# Altium schematic sheet 降压稳压供电SCH.SchDoc: 降压稳压供电电路
size A4; Author: 许皓阳 15电4; DrawnBy: Staok; Revision: 3.14
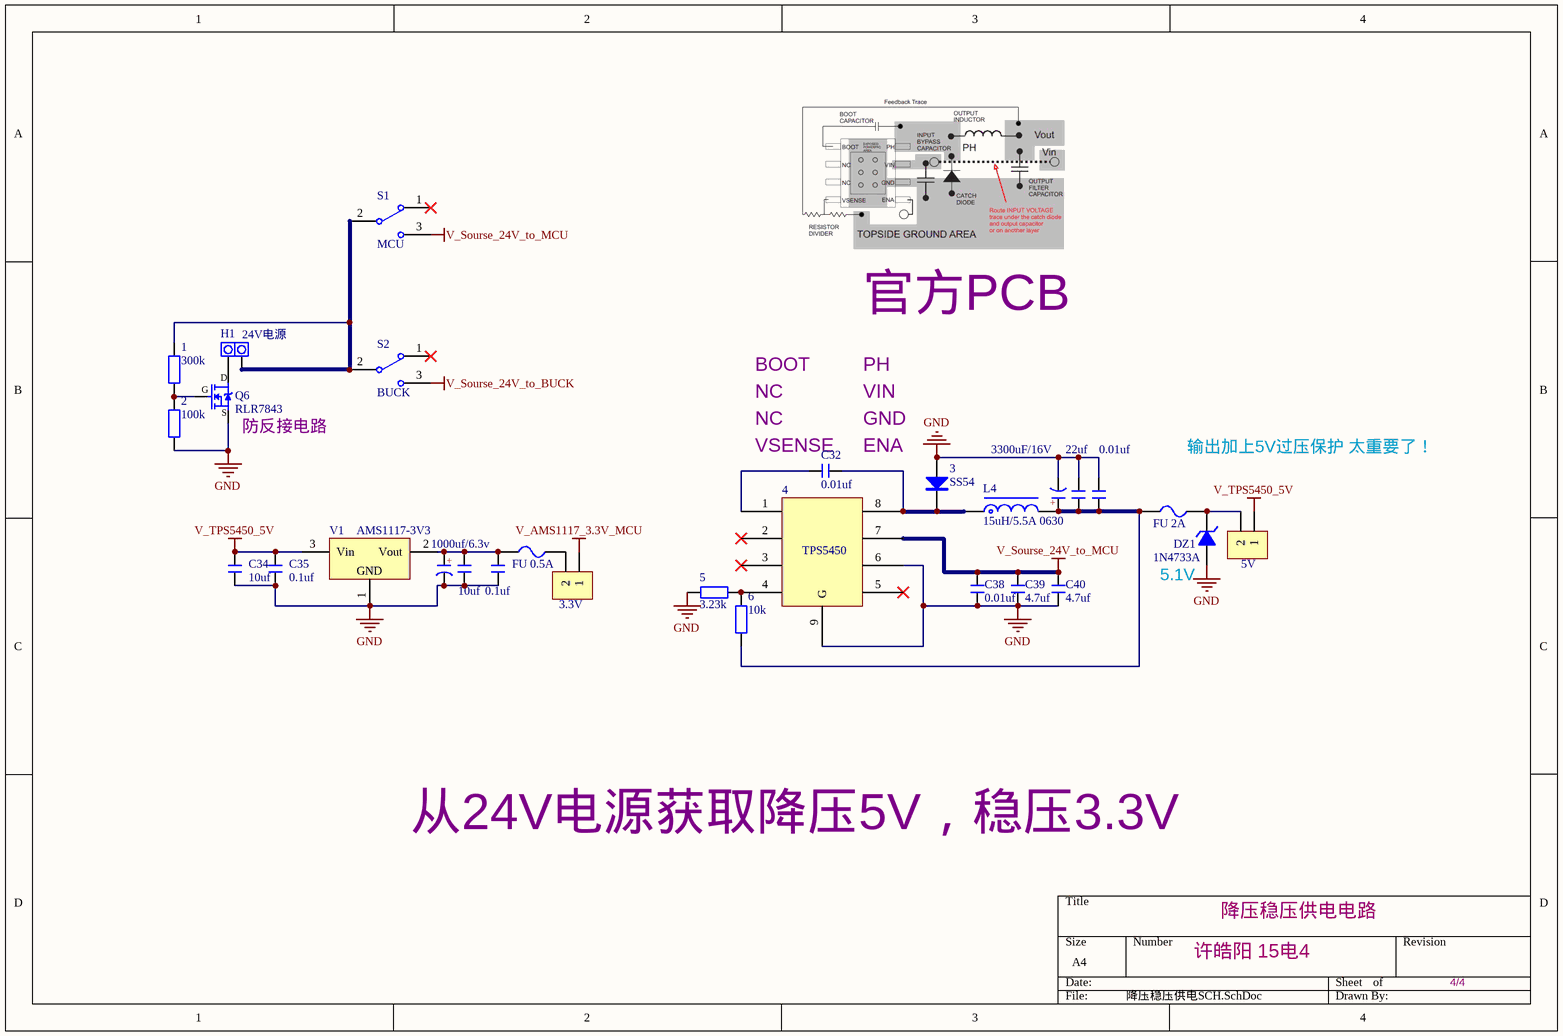
[diagram p0: 降压稳压供电SCH.SchDoc]

## Parts
1  300k  [R 0805_M]
2  100k  [R 0805_M]
3  SS54  [SMA]
4  TPS5450  [ESOP8_M]
5  3.23k  [R 0805_M]
6  10k  [R 0805_M]
C32  0.01uf  [C 0805_M]
C33  0.01uf  [C 0805_M]
C34  10uf  [C 0805_M]
C35  0.1uf  [C 0805_M]
C36  10uf  [C 0805_M]
C36.  22uf  [C 0805_M]
C37  0.1uf  [C 0805_M]
C38  0.01uf  [C 0805_M]
C39  4.7uf  [C 0805_M]
C40  4.7uf  [C 0805_M]
DZ1  1N4733A  [DO-35]
E1  3300uF/16V  [DIP2]
E2  1000uf/6.3v  [DIP2-3.5mm]
F2  FU 2A  [FU 1812]
F3  FU 0.5A  [FU 1206]
H1  24V电源  [T_head]
JP10  5V  [HDR2.54-LI-2P]
JP11  3.3V  [HDR2.54-LI-2P]
L4  15uH/5.5A 0630  [L-SMD-0630]
Q6  RLR7843  [TO252]
S1  MCU  [SK-12D07VG3]
S2  BUCK  [MTS-10x]
V1  AMS1117-3V3  [SOT89_M]

## Nets
GND: 2.1 3.1(A) 4.6 4.9(G) 5.1 C33.2 C34.2 C35.2 C36.2 C36..1 C37.2 C38.1 C39.1 C40.1 DZ1.1(A) E1.2(K) E2.2(K) Q6.3(S) V1.1(GND)
V_AMS1117_3.3V_MCU: JP11.1
V_Sourse_24V_to_BUCK: S2.3
V_Sourse_24V_to_MCU: 4.7 C38.2 C39.2 C40.2 S1.3
V_TPS5450_5V: C34.1 C35.1 JP10.1 V1.3(Vin)
Net1_1: 1.1 2.2 Q6.1(G)
Net1_2: 1.2 H1.2 S1.2 S2.2
Net3_2: 3.2(K) 4.8 C32.2 L4.1
Net4_1: 4.1 C32.1
Net4_4: 4.4 5.2 6.1
Net6_2: 6.2 C33.1 C36..2 E1.1(A) F2.1 L4.2
NetC36_1: C36.1 C37.1 E2.1(A) F3.1 V1.2(Vout)
NetDZ1_2: DZ1.2(K) F2.2 JP10.2
NetF3_2: F3.2 JP11.2
NetH1_1: H1.1 Q6.2(D)

Not connected (* = marked no-connect by the designer): 4 2* 3* 5*; S1 1*; S2 1*

## Notes on the sheet
- BOOT
- PH
- 官方PCB
- (near Q6) 防反接电路
- NC
- GND
- VIN
- (near C32) VSENSE
- ENA
- 输出加上5V过压保护 太重要了！
- (near DZ1) 5.1V
- 从24V电源获取降压5V，稳压3.3V
- 4/4
- (in symbol C-CAP) +

## Library data of the parts
1 2 5 6 = R: 贴片电阻; 版权归属: 源创客; BOM名称: 贴片电阻; 学习资源: www.ooocke.com
3 = SS34: 肖特基二极管; 版权归属: 源创客; 属性: 40V/3A; BOM名称: 肖特基二极管; 学习资源: www.ooocke.com
4 = ESOP8
C32-C36 C36. C37-C40 = C: 无极性贴片电容; 版权归属: 源创客; BOM名称: 无极性贴片电容; 学习资源: www.ooocke.com
DZ1 = 1N4620: 3.3V/0.5W稳压管; 版权归属: 源创客; BOM名称: 3.3V/0.5W稳压管; 学习资源: www.ooocke.com
E1 E2 = C-CAP: 直插电解电容; 版权归属: 源创客; BOM名称: 直插电解电容; 学习资源: www.ooocke.com
F2 F3 = FU: 贴片保险丝; 版权归属: 源创客; BOM名称: 贴片保险丝; 学习资源: www.ooocke.com
H1 = PAD2: 引线焊盘; 版权归属: 源创客; BOM名称: 引线焊盘; 学习资源: www.ooocke.com
JP10 JP11 = Header 2: 2P接插件; 版权归属: 源创客; BOM名称: 2P接插件; 学习资源: www.ooocke.com
L4 = L-CDRH: 功率屏蔽电感; 版权归属: 源创客; BOM名称: 功率屏蔽电感; 学习资源: www.ooocke.com
Q6 = 2SK3615: N沟道 60V/12A; BOM名称: 场效应管; 版权归属: 源创客; 学习资源: www.ooocke.com; 描述: N沟道 60V/12A
S1 = SSW-1P: 1路波动开关; BOM名称: 波动开关; 版权归属: 源创客; 学习资源: www.ooocke.com
S2 = MTS-10x: MTS10x系列3脚扭子开关; 版权归属: 源创客; BOM名称: MTS10x系列3脚扭子开关; 学习资源: www.ooocke.com
V1 = AMS1117: 三端稳压芯片; BOM名称: 稳压芯片; 版权归属: 源创客; 学习资源: www.ooocke.com